# EAGLE design ghf_sensor (EAGLE 6.6.0)
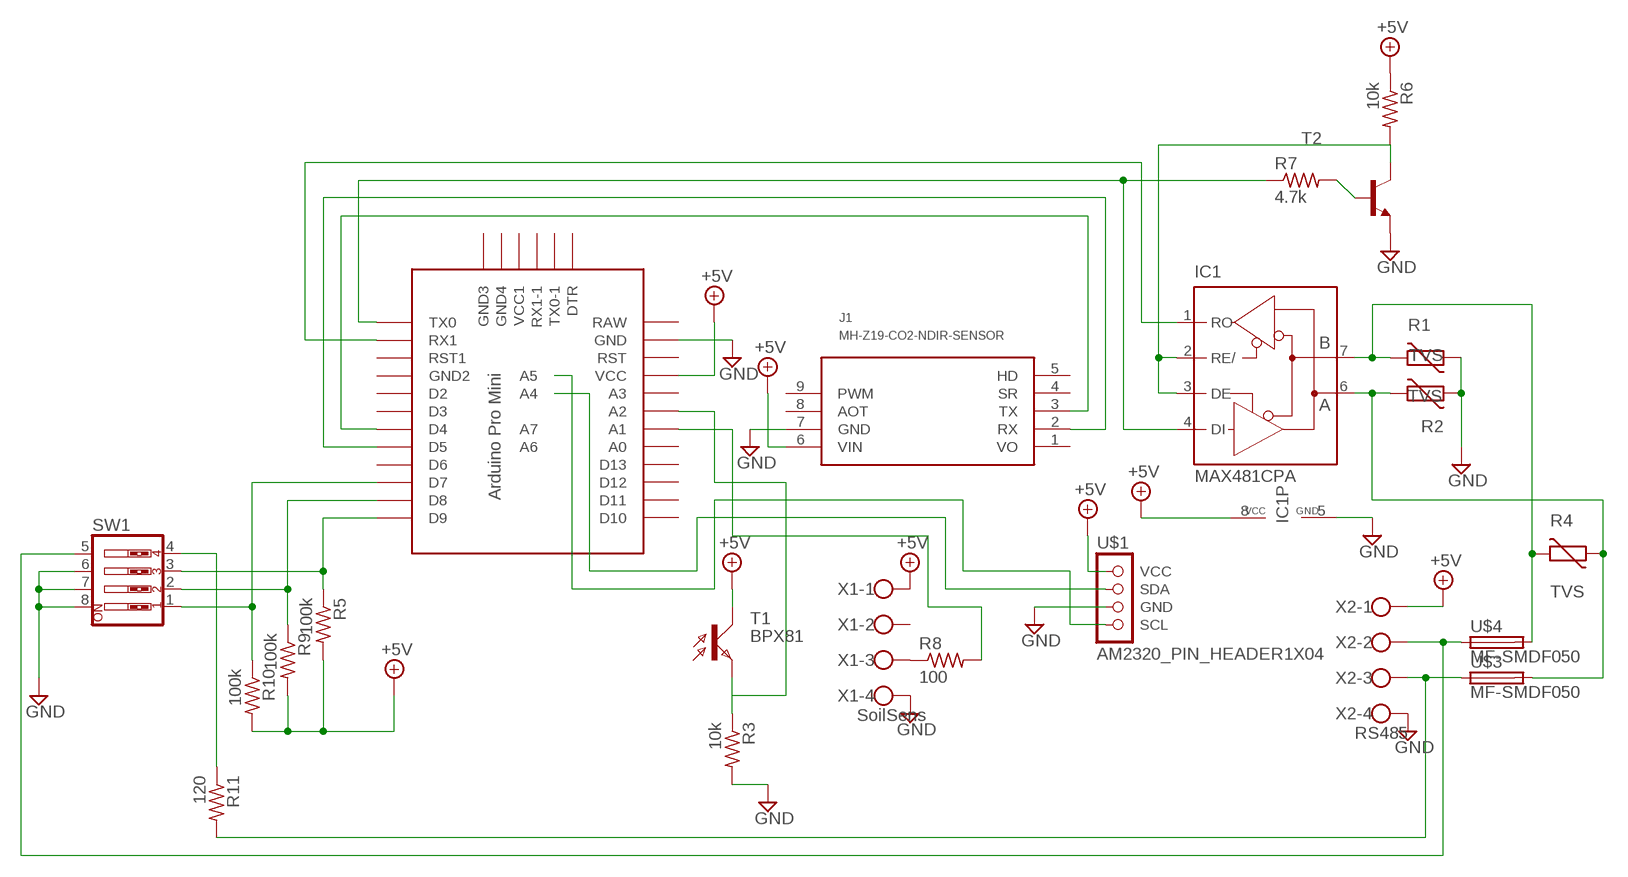
[diagram p0: schematic, sheet 1]

## Parts
IC1  MAX481CPA  [DIL08]
J1  MH-Z19-CO2-NDIR-SENSOR  [MH-Z19]
R1  TVS  VARISTORCN1812  [CT/CN1812]
R2  TVS  VARISTORCN1812  [CT/CN1812]
R3  10k  R-US_0204/5  [0204/5]
R4  TVS  VARISTORCN1812  [CT/CN1812]
R5  100k  R-US_0204/2V  [0204V]
R6  10k  R-US_0204/5  [0204/5]
R7  4.7k  R-US_0204/5  [0204/5]
R8  100  R-US_0204/5  [0204/5]
R9  100k  R-US_0204/2V  [0204V]
R10  100k  R-US_0204/2V  [0204V]
R11  120  R-US_0204/2V  [0204V]
SW1  SW_DIP-4  [EDG-04]
T1  BPX81  [BPX81]
T2  -NPN-TO92-ECB  [TO92-ECB]
U$1  AM2320_PIN_HEADER1X04  [1X04]
U$2  PRO-MINI-2  [PRO-MINI-2]
U$3  MF-SMDF050  [MF-SMDF050]
U$4  MF-SMDF050  [MF-SMDF050]
X1  SoilSens  W237-4  [W237-4]
X2  RS485  W237-4  [W237-4]

## Nets
+5V: IC1.8(VCC) J1.6(VIN) R5.2 R6.1 R9.2 R10.2 T1.C U$1.1(VCC) U$2.VCC X1.1 X2.1
GND: IC1.5(GND) J1.7(GND) R1.1 R2.2 R3.2 SW1.6 SW1.7 SW1.8 T2.E U$1.3(GND) U$2.GND X1.4 X2.4
N$1: R3.1 T1.E U$2.A2
N$2: SW1.5 U$4.1 X2.2
N$3: R11.2 U$3.1 X2.3
N$6: J1.3(TX) U$2.D4
N$7: J1.2(RX) U$2.D5
N$8: R8.1 X1.3
N$9: IC1.1(RO) U$2.RX1
N$10: U$1.2(SDA) U$2.A4
N$11: U$1.4(SCL) U$2.A5
N$12: R5.1 SW1.3 U$2.D9
N$13: IC1.2(RE/) IC1.3(DE) R6.2 T2.C
N$14: R7.2 T2.B
N$15: IC1.4(DI) R7.1 U$2.TX0
N$16: R8.2 U$2.A1
N$18: R9.1 SW1.2 U$2.D8
N$19: R10.1 SW1.1 U$2.D7
N$20: R11.1 SW1.4
N$21: IC1.7(B) R1.2 R4.2 U$4.2
N$22: IC1.6(A) R2.1 R4.1 U$3.2
Unconnected: J1.4(SR) J1.5(HD) J1.8(AOT) J1.9(PWM) U$2.A0 U$2.A3 U$2.A6 U$2.A7 U$2.D2 U$2.D3 U$2.D6 U$2.D10 U$2.D11 U$2.D12 U$2.D13 U$2.DTR U$2.GND1(GND2) U$2.GND2(GND3) U$2.GND3(GND4) U$2.RAW U$2.RST U$2.RST1 U$2.RX1-1 U$2.TX0-1 U$2.VCC1 X1.2

## Power pins joined to a net without a drawn wire
VO: J1.1(VO)

## Library data of the parts
IC1 = maxim:MAX481CPA: RS485 TRANSEIVER
J1 = mh-z19:MH-Z19: MH-Z19 - CO2 NDIR SENSOR
R1 R2 R4 = varistor:VARISTOR: VARISTOR
R3 R5-R11 = rcl:R-US_: RESISTOR, American symbol
SW1 = special:SW_DIP-4: DIP SWITCH
T1 = opto-trans-siemens:BPX81: PHOTO TRANSISTOR
T2 = transistor:*-NPN-: NPN Transistror BF959 corrected 2008.03.06
U$1 = diy-drohne200:AM2320_PIN_HEADER: AM2320B Connector AM2320 pin assignment i2C or 1-Wir Pin Name Description 1 VDD Power supply(3.1-5.5V) 2 SDA Serial data, bidirectional port (1 Wire - connect SCL GND) 3 GND Ground 4 SCL Serial clock input port (single bus ground) Description <https://akizukidenshi.com/download/ds/aosong/AM2320.pdf>
U$2 = Arduino-clone:PRO-MINI-2: Arduino Pro Mini Layout 2 Sparkfun.com
U$3 U$4 = fuse:MF-SMDF: MF-SMDF Series - PRC Resettable Fuses Source: http://www.farnell.com/datasheets/716597.pdf
X1 X2 = con-wago-500:W237-4: WAGO SCREW CLAMP; OC_FARNELL: unknown; OC_NEWARK: unknown

## Board
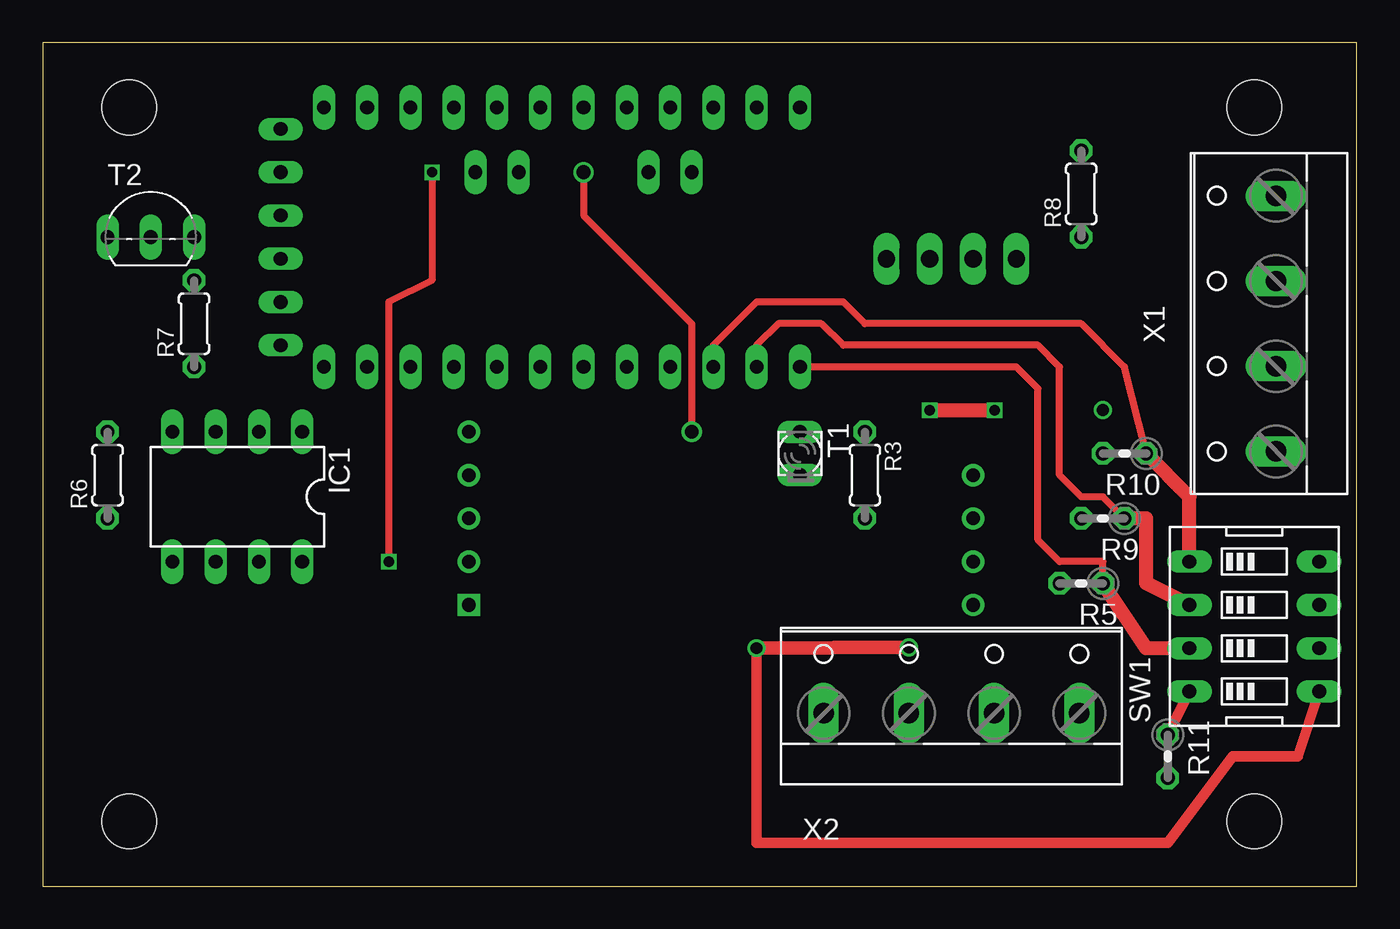
[diagram p1: board, top side]
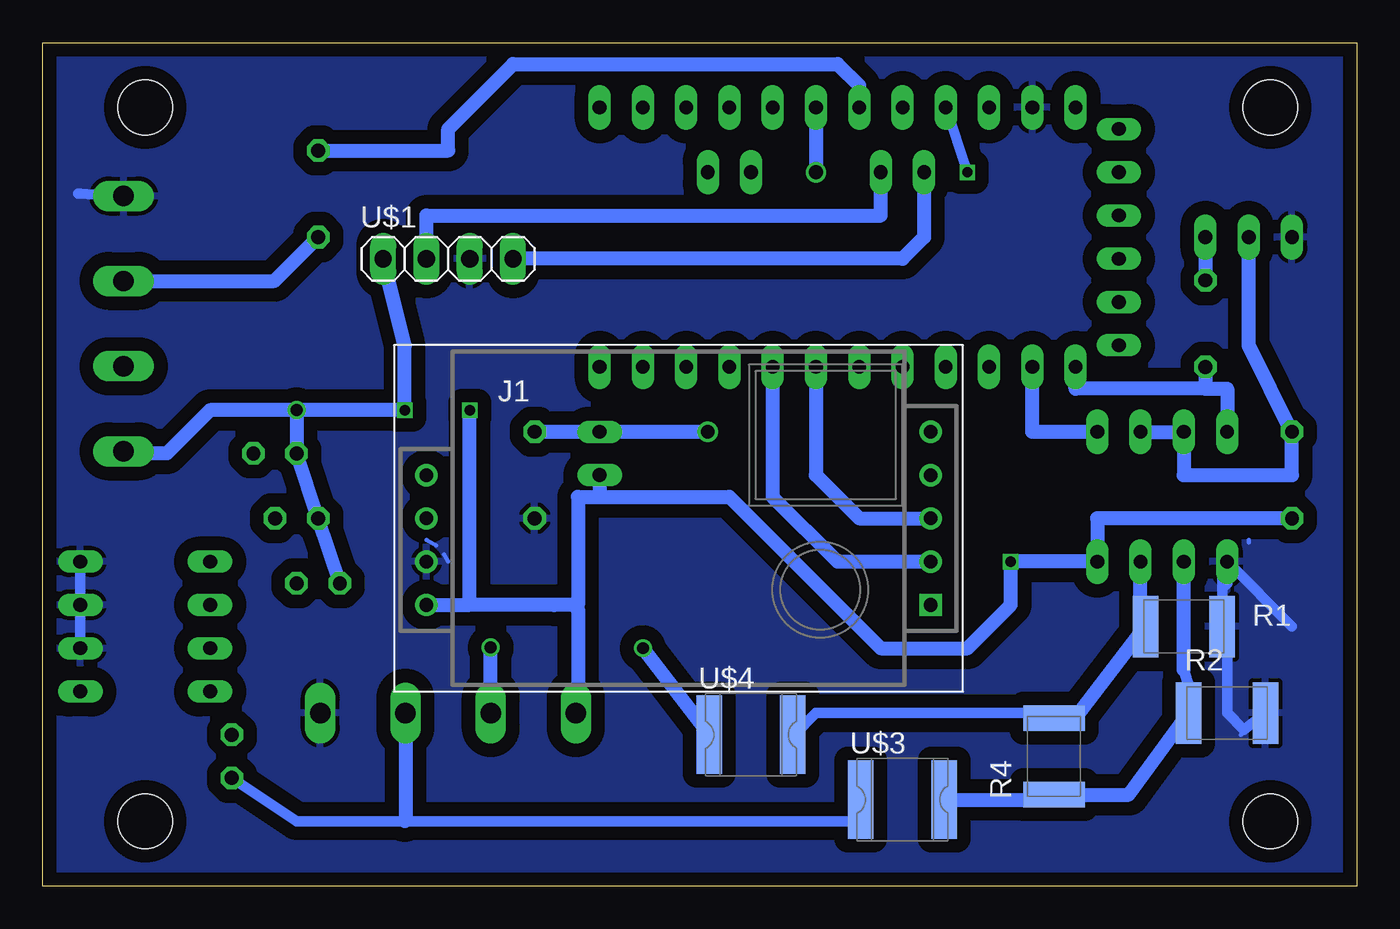
[diagram p2: board, bottom side, seen from below]

Size 77.14 x 49.52 mm. Coordinates in mm from the lower left corner, seen from the top.
Outline: 0,0 77.14,0 77.14,49.52 0,49.52 0,0
Copper layers (1*16): Top 0.035mm / dielectric 1.5mm / Bottom 0.035mm
Design rules "ssci_SeeedStudio_2layer_DRU_no_angle": minimum track width 6mil, minimum drill 12mil, track to track 6mil, track to pad 6mil, pad to pad 6mil, via to via 6mil, smd to smd 0mil, copper to edge 10mil, drill to drill 10mil, minimum pad ring 10mil, minimum via ring 6mil, stop-mask expansion 2mil, vias tented up to drill 25mil, thermal gap 10mil
Holes 3.2 mm at 5.08,3.81 5.08,45.72 71.12,45.72 71.12,3.81

### Footprints (pad centres in the part's own frame; a part is rotated, then mirrored left to right if it is on the bottom)
DIL08 = drill 0.813 long: 1 -3.81,-3.81; 2 -1.27,-3.81; 3 1.27,-3.81; 4 3.81,-3.81; 5 3.81,3.81; 6 1.27,3.81; 7 -1.27,3.81; 8 -3.81,3.81
MH-Z19 = drill 0.8 square: 1 29.591,0 | drill 0.8: 2 29.591,2.54; 3 29.591,5.08; 4 29.591,7.62; 5 29.591,10.16; 6 0,0; 7 0,2.54; 8 0,5.08; 9 0,7.62
CT/CN1812 = smd 1.5 x 3.6: 1 -2.25,0; 2 2.25,0
0204/5 = drill 0.813 octagon: 1 -2.54,0; 2 2.54,0
0204V = drill 0.813 octagon: 1 -1.27,0; 2 1.27,0
EDG-04 = drill 0.813 long: 1 -3.81,-3.81; 2 -1.27,-3.81; 3 1.27,-3.81; 4 3.81,-3.81; 5 3.81,3.81; 6 1.27,3.81; 7 -1.27,3.81; 8 -3.81,3.81
BPX81 = drill 0.813 long: C 1.27,0; E -1.27,0
TO92-ECB = drill 0.813 long: B 2.54,0; C 0,0; E -2.54,0
1X04 = drill 1.016 long: 1 -3.81,0; 2 -1.27,0; 3 1.27,0; 4 3.81,0
PRO-MINI-2 = drill 0.8 long: A0 6.35,2.54; A1 6.35,0; A2 6.35,-2.54; A3 6.35,-5.08; A4 2.54,1.27; A5 2.54,3.81; A6 2.54,-8.89; A7 2.54,-6.35; D2 -8.89,2.54; D3 -8.89,0; D4 -8.89,-2.54; D5 -8.89,-5.08; D6 -8.89,-7.62; D7 -8.89,-10.16; D8 -8.89,-12.7; D9 -8.89,-15.24; D10 6.35,-15.24; D11 6.35,-12.7; D12 6.35,-10.16; D13 6.35,-7.62; DTR 5.08,15.24; GND 6.35,10.16; GND1 -8.89,5.08; GND2 -7.62,15.24; GND3 -5.08,15.24; RAW 6.35,12.7; RST 6.35,7.62; RST1 -8.89,7.62; RX1 -8.89,10.16; RX1-1 0,15.24; TX0 -8.89,12.7; TX0-1 2.54,15.24; VCC 6.35,5.08; VCC1 -2.54,15.24
MF-SMDF050 = smd 1.5 x 4.6: 1 -2.45,0; 2 2.45,0
W237-4 = drill 1.194 long: 1 -7.5,-1.27; 2 -2.5,-1.27; 3 2.5,-1.27; 4 7.5,-1.27

### Placement (x,y rotation side)
IC1  11.43,22.86 180 top
J1  54.61,16.51 0 bottom
R1  10.16,15.24 180 bottom
R2  7.62,10.16 0 bottom
R3  48.26,24.13 270 top
R4  17.78,7.62 90 bottom
R5  60.96,17.78 180 top
R6  3.81,24.13 90 top
R7  8.89,33.02 90 top
R8  60.96,40.64 90 top
R9  62.23,21.59 180 top
R10  63.5,25.4 180 top
R11  66.04,7.62 270 top
SW1  71.12,15.24 270 top
T1  44.45,25.4 270 top
T2  6.35,38.1 0 top
U$1  53.34,36.83 0 bottom
U$2  29.21,39.37 90 top
U$3  26.67,5.08 0 bottom
U$4  35.56,8.89 0 bottom
X1  71.12,33.02 90 top
X2  53.34,11.43 0 top

### Tracks (layer width: path | path; a pad name or v marks a point on that pad's centre or on a via)
+5V  (via drill 0.6, 0.7)
  Top 0.406: v22.86,41.91 22.86,35.56 20.32,34.29 v20.32,19.05
  Top 0.813: v52.07,27.94 v55.88,27.94
  Bottom 0.61: U$2.VCC v22.86,41.91 | 47.11,16.39 46.99,16.51 | 72.27,25.4 X1.1
  Bottom 0.813: U$1.1 55.88,31.75 v55.88,27.94 v62.23,27.94 | 45.72,16.51 45.72,22.86 44.45,22.86 | 45.72,16.51 46.99,16.51 52.07,16.51 | J1.6 52.07,16.51 | 52.07,16.51 v52.07,27.94 | 44.45,22.86 36.83,22.86 27.94,13.97 22.86,13.97 20.32,16.51 v20.32,19.05 IC1.8 15.24,21.59 R6.1 | 72.27,25.4 69.85,25.4 67.31,27.94 v62.23,27.94 | 45.72,16.51 45.84,16.39 45.72,16.27 45.72,10.28 X2.1 | R5.2 R9.2 R10.2 v62.23,27.94 | T1.C 44.45,22.86
GND
  Bottom 0.254: 6.81,8.89 R2.2 | 53.34,19.05 53.58,19.48 | 54.61,20.32 54.05,20.01 | 6.35,20.32 6.35,20.17
  Bottom 0.61: 7.91,17.49 7.62,17.78 IC1.5 | R2.2 6.64,9.18 7.62,10.16 7.62,13.68 R1.1 7.91,18.76 IC1.5 | IC1.5 3.81,15.24 | SW1.6 SW1.7 SW1.8 | 74.93,40.64 75.05,40.64 X1.4
  pour Bottom (isolate 0.813): 0,49.53 77.47,49.53 77.47,-1.27 0,-1.27
N$1  (via drill 0.8 pad 1.02)
  Top 0.406: v31.75,41.91 31.75,39.37 38.1,33.02 v38.1,26.67
  Bottom 0.813: R3.1 T1.E v38.1,26.67 | U$2.A2 v31.75,41.91
N$2  (via drill 0.7)
  Top 0.61: SW1.5 73.66,7.62 69.85,7.62 66.04,2.54 41.91,2.54 v41.91,13.97
  Top 0.813: v50.84,14.01 v41.91,13.97
  Bottom 0.813: X2.2 v50.84,14.01 | v41.91,13.97 U$4.1
N$3
  Bottom 0.61: U$3.1 29.12,3.9 29.21,3.81 55.88,3.81 62.23,3.81 R11.2
  Bottom 0.813: X2.3 55.84,3.85 55.88,3.81
N$6
  Bottom 0.254: 25.4,21.59 J1.3
  Bottom 0.813: 25.4,21.59 29.21,21.59 31.75,24.13 U$2.D4
N$7
  Bottom 0.254: 25.4,19.05 J1.2
  Bottom 0.813: 25.4,19.05 30.48,19.05 34.29,22.86 U$2.D5
N$8
  Bottom 0.813: X1.3 63.54,35.52 R8.1
N$9
  Bottom 0.813: IC1.1 19.05,26.67 U$2.RX1
N$10
  Bottom 0.813: U$1.2 54.61,39.37 27.94,39.37 U$2.A4
N$11
  Bottom 0.813: U$2.A5 25.4,38.1 26.67,36.83 U$1.4
N$12
  Top 0.406: R5.1 62.23,19.05 59.69,19.05 58.42,20.32 58.42,29.21 57.15,30.48 U$2.D9
  Top 0.813: SW1.3 64.77,13.97 R5.1
N$13
  Bottom 0.813: IC1.2 IC1.3 10.16,24.13 3.81,24.13 R6.2 6.35,31.75 T2.C
N$14
  Bottom 0.813: T2.B R7.2
N$15
  Bottom 0.813: R7.1 8.89,29.21 | 8.89,29.21 7.62,29.21 IC1.4 | 8.89,29.21 16.51,29.21 U$2.TX0
N$16
  Bottom 0.813: R8.2 53.34,43.18 53.34,44.45 49.53,48.26 30.48,48.26 29.21,46.99 U$2.A1
N$18
  Top 0.406: R9.1 62.23,22.86 60.96,22.86 59.69,24.13 59.69,30.48 58.42,31.75 46.99,31.75 45.72,33.02 43.18,33.02 41.91,31.75 U$2.D8
  Top 0.813: SW1.2 64.77,17.78 64.77,21.59 R9.1
N$19
  Top 0.406: R10.1 63.5,30.48 60.96,33.02 48.26,33.02 46.99,34.29 41.91,34.29 39.37,31.75 U$2.D7
  Top 0.813: SW1.1 67.31,22.86 R10.1
N$20
  Top 0.61: R11.1 SW1.4
N$21
  Bottom 0.406: R4.2 16.51,9.87
  Bottom 0.61: U$4.2 33.02,8.89 31.75,10.16 18.07,10.16 | R1.2 12.41,14.95 12.7,15.24
  Bottom 0.813: 18.07,10.16 R4.2 | 12.7,15.24 IC1.7 | 16.51,9.87 R1.2
N$22
  Bottom 0.61: 17.78,5.08 R4.1 | 9.87,11.72 10.16,12.7
  Bottom 0.813: U$3.2 17.78,5.08 | R4.1 13.39,5.37 R2.1 9.87,11.72 | 10.16,12.7 IC1.6